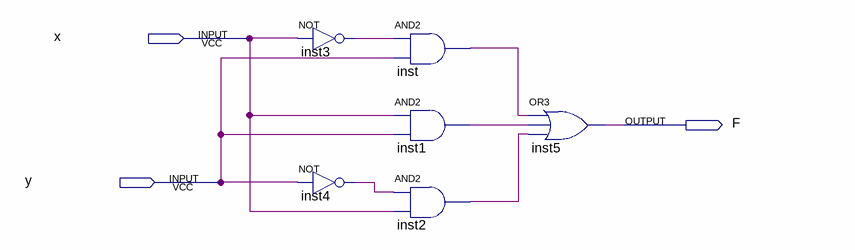
[diagram p0: schematic sheet]
// Quartus schematic Exercise1Question3.bdf as structural Verilog: 6 symbols, 3 pins
module Exercise1Question3 (
  input  x,
  input  y,
  output F
);

  wire inst1_out, inst2_out, inst3_out, inst4_out, inst_out;

  not inst3 (inst3_out, x);
  not inst4 (inst4_out, y);
  and inst (inst_out, inst3_out, y);
  and inst1 (inst1_out, x, y);
  and inst2 (inst2_out, inst4_out, x);
  or inst5 (F, inst_out, inst1_out, inst2_out);
endmodule
